# EAGLE design UPCH (EAGLE 7.5.0)
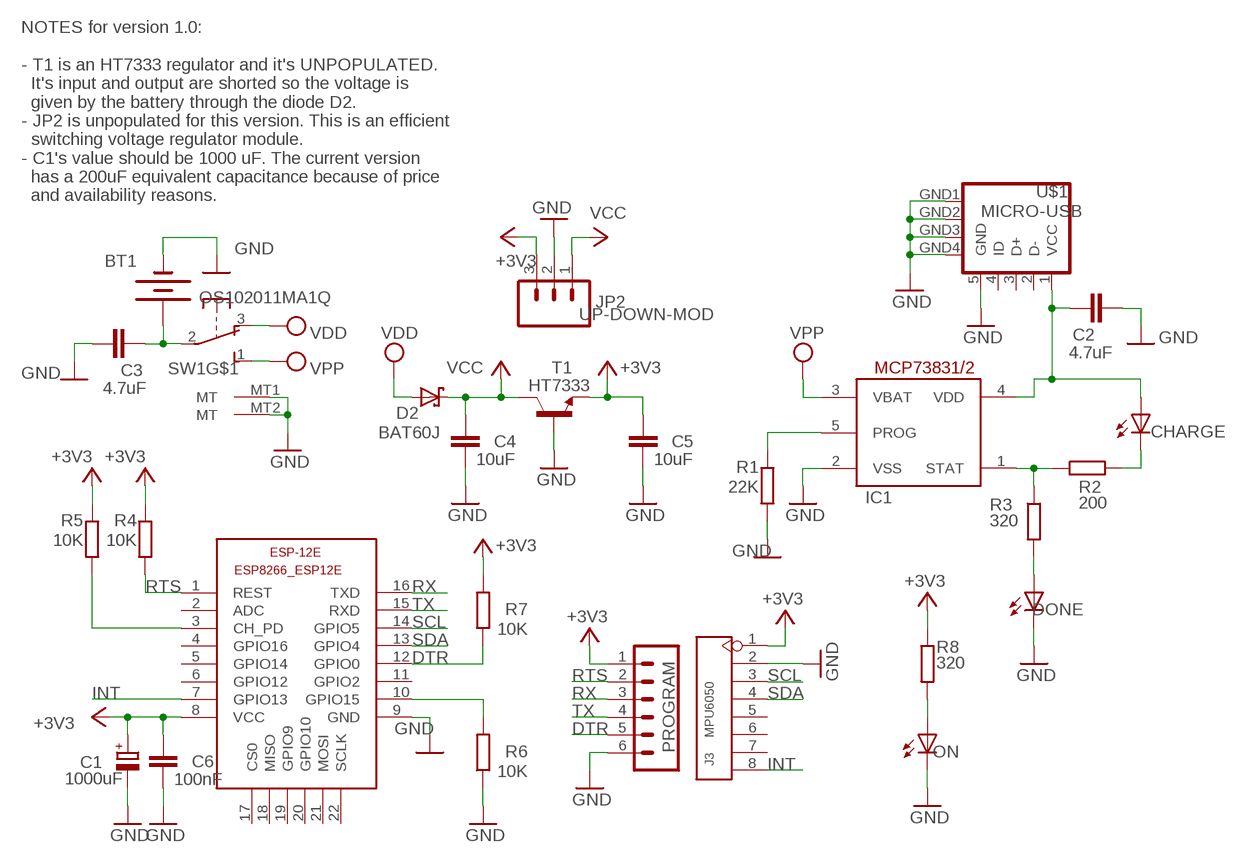
[diagram p0: schematic, sheet 1]

## Parts
BT1  BATTERY24.5MM  [BATTCON_24.5MM]
C1  1000uF  CPOL-EUD/7343-31W  [D/7343-31W]
C2  4.7uF  C-EUC1206  [C1206]
C3  4.7uF  C-EUC1206  [C1206]
C4  10uF  C-EUC1206  [C1206]
C5  10uF  C-EUC1206  [C1206]
C6  100nF  C-EUC1206  [C1206]
CHARGE  LEDCHIP-LED0603  [CHIP-LED0603]
D2  BAT60J  [SOD323_ST]
DONE  LEDCHIP-LED0603  [CHIP-LED0603]
ESP-12E  ESP8266-12EESP8266-ESP12E  [ESP8266-ESP12E]
IC1  MCP73831  MCP73831/OT  [SOT23-5L]
J3  MPU6050  SMD-BLACK-FEMALE-HEADER(8P-2.54-90D)  [H8-SMD-2.54-90D]
JP2  UP-DOWN-MOD  M03PTH  [1X03]
ON  LEDCHIP-LED0603  [CHIP-LED0603]
PROGRAM  CONN_06SILK_FEMALE_PTH  [1X06]
R1  22K  R-EU_R0603  [R0603]
R2  200  R-EU_R1206  [R1206]
R3  320  R-EU_R0603  [R0603]
R4  10K  R-EU_R0603  [R0603]
R5  10K  R-EU_R0603  [R0603]
R6  10K  R-EU_R0603  [R0603]
R7  10K  R-EU_R1206  [R1206]
R8  320  R-EU_R0603  [R0603]
SW1  OS102011MA1Q  [OS102011MA1Q]
T1  HT7333  -NPN-SOT89-BCE  [SOT89-BCE]
U$1  MICRO-USB  [MICRO-USB]

## Nets
+3V3: C1.+ C5.1 C6.1 ESP-12E.8(VCC) J3.1 JP2.3 PROGRAM.1 R4.2 R5.2 R7.2 R8.1 T1.E
DTR: ESP-12E.12(GPIO0) PROGRAM.5 R7.1
GND: BT1.2(-) C1.- C2.2 C3.2 C4.2 C5.2 C6.2 DONE.C ESP-12E.9(GND) IC1.2(VSS) J3.2 JP2.2 ON.C PROGRAM.6 R1.1 R6.1 SW1.MT1(MT) SW1.MT2(MT) T1.B U$1.5(GND) U$1.GND1(GND) U$1.GND2(GND) U$1.GND3(GND) U$1.GND4(GND)
INT: ESP-12E.7(GPIO13) J3.8
N$1: DONE.A R3.2
N$2: IC1.5(PROG) R1.2
N$3: CHARGE.C R2.2
N$4: BT1.1(+) C3.1 SW1.2(P)
N$5: IC1.1(STAT) R2.1 R3.1
N$6: ESP-12E.3(CH_PD) R5.1
N$7: ESP-12E.10(GPIO15) R6.2
N$8: ON.A R8.2
N$9: C2.1 CHARGE.A IC1.4(VDD) U$1.1(VCC)
RTS: ESP-12E.1(REST) PROGRAM.2 R4.1
RX: ESP-12E.16(TXD) PROGRAM.3
SCL: ESP-12E.14(GPIO5) J3.3
SDA: ESP-12E.13(GPIO4) J3.4
TX: ESP-12E.15(RXD) PROGRAM.4
VCC: C4.1 D2.C JP2.1 T1.C
VDD: D2.A SW1.3(O)
VPP: IC1.3(VBAT) SW1.1(S)
Unconnected: ESP-12E.2(ADC) ESP-12E.4(GPIO16) ESP-12E.5(GPIO14) ESP-12E.6(GPIO12) ESP-12E.11(GPIO2) ESP-12E.17(CS0) ESP-12E.18(MISO) ESP-12E.19(GPIO9) ESP-12E.20(GPIO10) ESP-12E.21(MOSI) ESP-12E.22(SCLK) J3.5 J3.6 J3.7 U$1.2(D-) U$1.3(D+) U$1.4(ID)

## Notes on the sheet
- NOTES for version 1.0:
  
  - T1 is an HT7333 regulator and it's UNPOPULATED.
    It's input and output are shorted so the voltage is
    given by the battery through the diode D2.
  - JP2 is unpopulated for this version. This is an efficient
    switching voltage regulator module.
  - C1's value should be 1000 uF. The current version
    has a 200uF equivalent capacitance because of price
    and availability reasons.

## Library data of the parts
BT1 = SparkFun-Retired:BATTERY: Battery - Single Cell A variety of battery chemistries, sizes, and footprints. Including AA, AAA, 18650 (PRT-12895), 20mm coin cell and 12mm coin cell. 20MM_4LEGS, BATT-10373
C1 = rcl:CPOL-EU: POLARIZED CAPACITOR, European symbol
C2-C6 = rcl:C-EU: CAPACITOR, European symbol
CHARGE DONE ON = led:LED: LED OSRAM: - CHIPLED LG R971, LG N971, LY N971, LG Q971, LY Q971, LO R971, LY R971 LH N974, LH R974 LS Q976, LO Q976, LY Q976 LO Q996 - Hyper CHIPLED LW Q18S LB Q993, LB Q99A, LB R99A - SideLED LS A670, LO A670, LY A670, LG A670, LP A670 LB A673, LV A673, LT A673, LW A673 LH A674 LY A675 LS A676, LA A676, LO A676, LY A676, LW A676 LS A679, LY A679, LG A679 - Hyper Micro SIDELED® LS Y876, LA Y876, LO Y876, LY Y876 LT Y87S - SmartLED LW L88C, LW L88S LB L89C, LB L89S, LG L890 LS L89K, LO L89K, LY L89K LS L896, LA L896, LO L896, LY L896 - TOPLED LS T670, LO T670, LY T670, LG T670, LP T670 LSG T670, LSP T670, LSY T670, LOP T670, LYG T670 LG T671, LOG T671, LSG T671 LB T673, LV T673, LT T673, LW T673 LH T674 LS T676, LA T676, LO T676, LY T676, LB T676, LH T676, LSB T676, LW T676 LB T67C, LV T67C, LT T67C, LS T67K, LO T67K, LY T67K, LW E67C LS E67B, LA E67B, LO E67B, LY E67B, LB E67C, LV E67C, LT E67C LW T67C LS T679, LY T679, LG T679 LS T770, LO T770, LY T770, LG T770, LP T770 LB T773, LV T773, LT T773, LW T773 LH T774 LS E675, LA E675, LY E675, LS T675 LS T776, LA T776, LO T776, LY T776, LB T776 LHGB T686 LT T68C, LB T68C - Hyper Mini TOPLED® LB M676 - Mini TOPLED Santana® LG M470 LS M47K, LO M47K, LY M47K Source: http://www.osram.convergy.de LUXEON: - LUMILED® LXK2-PW12-R00, LXK2-PW12-S00, LXK2-PW14-U00, LXK2-PW14-V00 LXK2-PM12-R00, LXK2-PM12-S00, LXK2-PM14-U00 LXK2-PE12-Q00, LXK2-PE12-R00, LXK2-PE12-S00, LXK2-PE14-T00, LXK2-PE14-U00 LXK2-PB12-K00, LXK2-PB12-L00, LXK2-PB12-M00, LXK2-PB14-N00, LXK2-PB14-P00, LXK2-PB14-Q00 LXK2-PR12-L00, LXK2-PR12-M00, LXK2-PR14-Q00, LXK2-PR14-R00 LXK2-PD12-Q00, LXK2-PD12-R00, LXK2-PD12-S00 LXK2-PH12-R00, LXK2-PH12-S00 LXK2-PL12-P00, LXK2-PL12-Q00, LXK2-PL12-R00 Source: www.luxeon.com KINGBRIGHT: KA-3528ASYC Source: www.kingbright.com
D2 = diode:BAT60J: Schottky barrier diode Source: www.st.com, BAT60J.pdf
ESP-12E = ESP8266-ESP12E:ESP8266-12E: ESP8266-12E with additional I/O and GPIO04/05 corrected The author cannot warrant that this library is free from error or will meet your specific requirements. Created by PuceBaboon.com. Komagane, Nagano, JAPAN
IC1 = adafruit:MCP73831: MCP73831/2 Miniature Single-Cell, Fully Integrated Li-Ion, Li-Polymer Charge Management Controllers. Nice and small simple lipoly charge controller, with adjustable current and status output (LED) http://www.ladyada.net/library/pcb/eaglelibrary.html
J3 = Seeed-OPL-Connector:SMD-BLACK-FEMALE-HEADER(8P-2.54-90D): 320030133; MPN: F185-1108A0BZYA1; VALUE: 8p-SMD-2.54-90d
JP2 = SparkFun:M03: Header 3 Standard 3-pin 0.1" header. Use with straight break away headers (SKU : PRT-00116), right angle break away headers (PRT-00553), swiss pins (PRT-00743), machine pins (PRT-00117), and female headers (PRT-00115). Molex polarized connector foot print use with SKU : PRT-08232 with associated crimp pins and housings.
PROGRAM = SparkFun-Connectors:CONN_06: Multi connection point. Often used as Generic Header-pin footprint for 0.1 inch spaced/style header connections On any of the 0.1 inch spaced packages, you can populate with these: Break Away Headers - Straight <https://www.sparkfun.com/products/116> (PRT-00116) Break Away Male Headers - Right Angle <https://www.sparkfun.com/products/553> (PRT-00553) Female Headers <https://www.sparkfun.com/products/115> (PRT-00115) Break Away Headers - Machine Pin <https://www.sparkfun.com/products/117> (PRT-00117) Break Away Female Headers - Swiss Machine Pin <https://www.sparkfun.com/products/743> (PRT-00743) Arduino Stackable Header - 6 Pin <https://www.sparkfun.com/products/9280> (PRT-09280) For SCREWTERMINALS and SPRING TERMINALS visit here: Screw Terimnals on SparkFun.com <https://www.sparkfun.com/search/results?term=Screw+Terminals> (5mm/3.5mm/2.54mm spacing) This device is also useful as a general connection point to wire up your design to another part of your project. Our various solder wires solder well into these plated through hole pads. Hook-Up Wire - Assortment (Stranded, 22 AWG) <https://www.sparkfun.com/products/11375> (PRT-11375) Hook-Up Wire - Assortment (Solid Core, 22 AWG) <https://www.sparkfun.com/products/11367> (PRT-11367) View the entire wire category on our website here <https://www.sparkfun.com/categories/141>; PROD_ID: CONN-08437
R1-R8 = rcl:R-EU_: RESISTOR, European symbol
SW1 = adafruit:OS102011MA1Q: OS10201MA1Q through-hole right angle switch http://www.ladyada.net/library/eagle
T1 = transistor:*-NPN-: NPN Transistror BF959 corrected 2008.03.06
U$1 = MicroUSB:MICRO-USB: Micro USB B connector

## Board
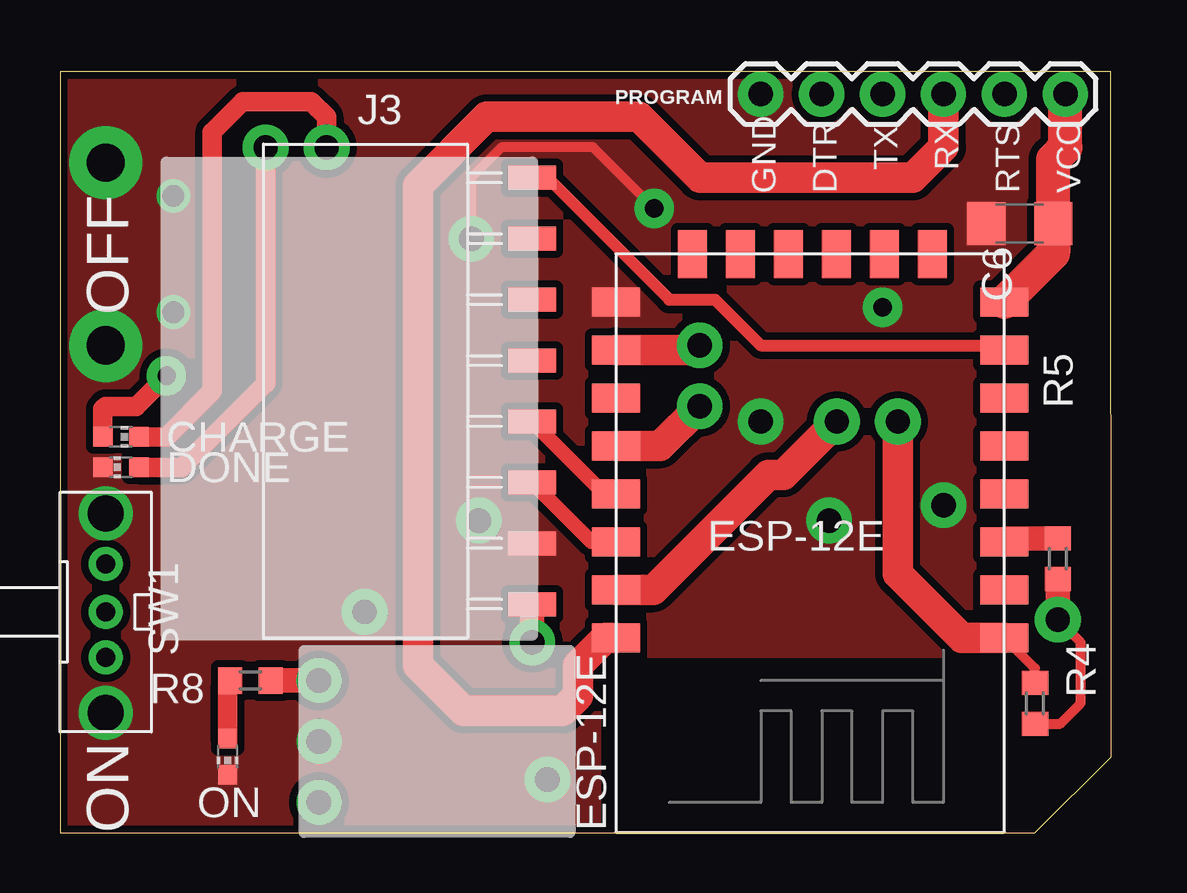
[diagram p1: board, top side]
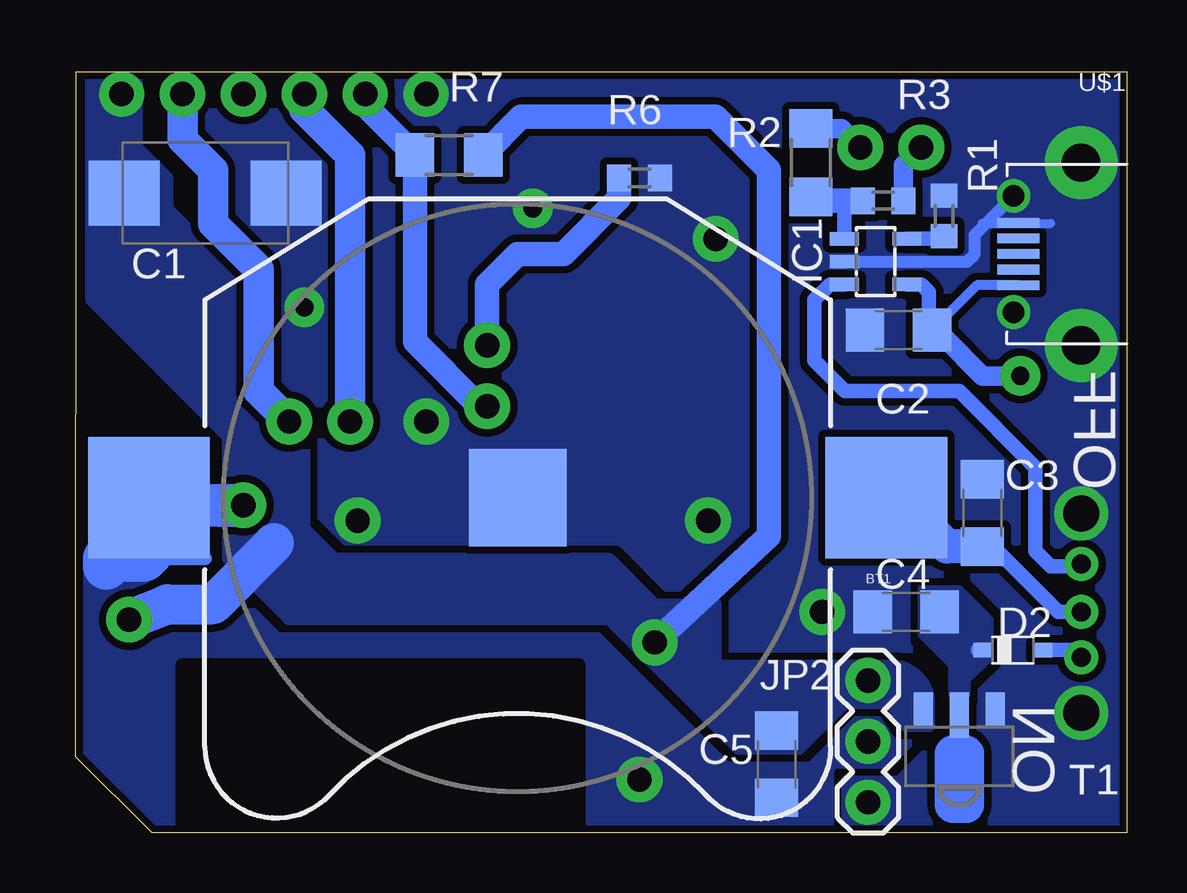
[diagram p2: board, bottom side, seen from below]

Size 43.81 x 31.74 mm. Coordinates in mm from the lower left corner, seen from the top.
Outline: 0,0 40.64,0 43.81,3.17 43.8,31.74 0,31.74 0,0
Copper layers (1*16): Top 0.035mm / dielectric 1.5mm / Bottom 0.035mm
Design rules "default *": minimum track width 6mil, minimum drill 10mil, track to track 6mil, track to pad 6mil, pad to pad 6mil, via to via 6mil, smd to smd 8mil, copper to edge 8mil, drill to drill 8mil, minimum pad ring 10mil, minimum via ring 8mil, stop-mask expansion 4mil, vias tented up to drill 0mil, thermal gap 10mil

### Footprints (pad centres in the part's own frame; a part is rotated, then mirrored left to right if it is on the bottom)
BATTCON_24.5MM = smd 5.08 x 5.08: 1 -15.367,0; 3 15.367,0 | smd 4.064 x 4.064: 2 0,0
D/7343-31W = smd 2.95 x 2.7: + 3.375,0; - -3.375,0
C1206 = smd 1.6 x 1.8: 1 -1.4,0; 2 1.4,0
CHIP-LED0603 = smd 0.8 x 0.8: A 0,-0.75; C 0,0.75
SOD323_ST = smd 0.8 x 0.6: A 1.25,0; C -1.25,0
ESP8266-ESP12E = smd 2 x 1.2: 1 -7.62,5.84; 2 -7.62,3.84; 3 -7.62,1.84; 4 -7.62,-0.16; 5 -7.62,-2.16; 6 -7.62,-4.16; 7 -7.62,-6.16; 8 -7.62,-8.16; 9 8.58,-8.16; 10 8.58,-6.16; 11 8.58,-4.16; 12 8.58,-2.16; 13 8.58,-0.16; 14 8.58,1.84; 15 8.58,3.84; 16 8.58,5.84 | smd 1.2 x 2: 17 -4.62,-10.16; 18 -2.62,-10.16; 19 -0.62,-10.16; 20 1.38,-10.16; 21 3.38,-10.16; 22 5.38,-10.16
SOT23-5L = smd 0.55 x 1.2: 1 -0.95,-1.3; 2 0,-1.3; 3 0.95,-1.3; 4 0.95,1.3; 5 -0.95,1.3
H8-SMD-2.54-90D = smd 2 x 1: 1 0,8.89; 2 0,6.35; 3 0,3.81; 4 0,1.27; 5 0,-1.27; 6 0,-3.81; 7 0,-6.35; 8 0,-8.89
1X03 = drill 1.016 pad 1.88: 1 0,0; 2 2.54,0; 3 5.08,0
1X06 = drill 1.016 pad 1.88: 1 0,0; 2 2.54,0; 3 5.08,0; 4 7.62,0; 5 10.16,0; 6 12.7,0
R0603 = smd 1 x 1.1: 1 -0.85,0; 2 0.85,0
R1206 = smd 1.6 x 1.803: 1 -1.422,0; 2 1.422,0
OS102011MA1Q = drill 0.8 pad 1.422: 1 -2,0; 2 0,0; 3 1.9,0 | drill 1.5 pad 2.184: MT1 -4.1,0; MT2 4.2,0
SOT89-BCE = smd 0.8 x 1.4: B -1.499,-1.981; E 1.499,-1.981 | smd 0.8 x 1.9: C 0,-1.727
MICRO-USB = smd 0.4 x 1.75: 1 -1.3,4.525; 2 -0.65,4.525; 3 0,4.525; 4 0.65,4.525; 5 1.3,4.525 | drill 1.6 pad 3.048: GND1 -3.81,1.905; GND2 3.81,1.905 | drill 0.9: GND3 -2.425,4.725; GND4 2.425,4.725

### Placement (x,y rotation side)
BT1  25.4,13.97 180 bottom
C1  38.42,26.67 180 bottom
C2  9.53,20.95 180 bottom
C3  6.03,13.34 90 bottom
C4  9.21,9.21 180 bottom
C5  14.61,2.86 270 bottom
C6  40.01,25.4 180 top
CHARGE  2.54,16.51 270 top
D2  4.76,7.62 0 bottom
DONE  2.54,15.24 90 top
ESP-12E  31.75,13.97 180 top
IC1  10.48,23.81 270 bottom
J3  19.68,18.41 180 top
JP2  10.79,1.27 90 bottom
ON  6.99,3.17 180 top
PROGRAM  41.91,30.8 180 top
R1  7.62,25.72 270 bottom
R2  13.18,27.94 90 bottom
R3  10.16,26.35 0 bottom
R4  40.64,5.4 270 top
R5  41.59,11.43 270 top
R6  20.32,27.3 180 bottom
R7  28.26,28.26 0 bottom
R8  7.94,6.35 180 top
SW1  1.91,9.21 270 top
T1  6.99,3.17 180 bottom
U$1  0,24.13 90 bottom

### Tracks (layer width: path | path; a pad name or v marks a point on that pad's centre or on a via)
+3V3  (via drill 1.02 pad 1.91)
  Top 0.406: v41.59,8.89 42.55,7.94 42.55,5.4 41.7,4.55 R4.2
  Top 1.016: v19.68,7.94 J3.1 | R5.2 v41.59,8.89 | R8.1 JP2.3
  Top 1.422: ESP-12E.8 41.41,24.16 C6.1 41.41,28.07 41.91,28.57 PROGRAM.1
  Bottom 1.016: v19.68,7.94 14.92,12.38 14.92,27.62 17.14,29.84 25.25,29.84 R7.2
  Bottom 1.676: v41.59,8.89 40.01,9.53 38.1,9.53 35.56,12.06
  pour Bottom (isolate 0.305, no thermals): 9.84,6.99 arc90 8.26,5.4 8.26,4.45 9.21,4.45 9.84,5.4 11.75,5.4 13.65,3.49 16.19,3.49 21.59,8.89 34.92,8.89 37.47,11.43 37.47,16.51 43.18,22.23 43.18,31.43 41.27,31.43 41.27,28.57 40.01,27.3 40.01,26.04 36.2,22.23 36.2,19.05 34.29,17.14 34.29,12.7 33.02,11.43 21.59,11.43 19.68,9.53 17.14,9.53 17.14,6.99
DTR  (via drill 1.02 pad 1.91)
  Top 1.27: ESP-12E.12 25.02,16.13 v26.67,17.78
  Bottom 1.016: PROGRAM.5 31.75,30.33 R7.1 29.68,20.47 26.99,17.78 v26.67,17.78
GND  (via drill 0.76 pad 1.65, 1.02 pad 1.91)
  Top 0.406: v24.77,26.04 22.23,28.57 18.41,28.57 17.14,27.3 v17.14,24.77
  Bottom 0.381: 6.03,25.4 3.17,25.4
  Bottom 0.406: IC1.2 11.75,23.81
  Bottom 0.508: 11.75,23.81 6.67,23.81 6.35,24.13 6.35,24.93 U$1.GND4
  Bottom 1.778: v36.83,13.65 40.96,13.65
  Bottom 1.93: 42.55,11.11 42.55,11.43 40.96,11.43 40.96,13.65 40.96,14.29
  other vias: 32.07,13.02 29.21,17.14 34.29,21.91 17.46,13.02 20.32,2.22 12.7,9.21
  pour Bottom (isolate 0.305, rank 3, no thermals): 0,31.75 43.81,31.75 43.81,3.17 40.64,0 0,0
  pour Top (isolate 0.305, rank 2, no thermals): 0,31.75 43.81,31.75 43.81,3.17 40.64,0 0,0
INT
  Top 0.508: J3.8 20.32,27.3 25.4,22.23 27.3,22.23 29.21,20.32 39.18,20.32 ESP-12E.7
N$1  (via drill 1.02 pad 1.91)
  Top 0.813: DONE.A 5.08,15.24 8.57,18.73 v8.57,28.57
  Bottom 0.813: R3.2 9.31,27.84 v8.57,28.57
N$2
  Bottom 0.61: IC1.5 7.72,24.76 R1.2
N$3  (via drill 1.02 pad 1.91)
  Top 0.813: CHARGE.C 4.45,16.51 6.35,18.41 6.35,29.21 7.62,30.48 10.48,30.48 11.11,29.84 v11.11,28.57
  Bottom 0.813: R2.2 11.9,29.36 v11.11,28.57
N$4
  Bottom 0.61: SW1.2 2.86,9.21 5.4,11.75 5.84,11.75 C3.1
  Bottom 1.422: C3.1 7.49,11.94 9.53,13.97 BT1.1
N$5
  Bottom 0.61: IC1.1 11.78,26.32 11.75,26.35
  Bottom 1.016: R3.1 11.75,26.35 12.53,26.35 R2.1
N$6
  Top 1.016: R5.1 39.52,12.28 ESP-12E.3
N$7  (via drill 1.02 pad 1.91)
  Top 1.27: ESP-12E.10 26.48,20.13 v26.67,20.32
  Bottom 1.016: v26.67,20.32 26.67,22.86 25.4,24.13 23.5,24.13 21.17,26.45 R6.2
N$8
  Top 0.813: ON.A 6.99,6.03 7.09,6.13 R8.2
N$9  (via drill 0.76 pad 1.65)
  Top 0.813: v4.45,19.05 3.17,17.78 1.91,17.78 1.79,17.66 CHARGE.A
  Bottom 0.406: U$1.1 6.25,22.83 C2.1
  Bottom 0.61: IC1.4 8.57,22.86 8.26,22.54 8.26,21.09 C2.1
  Bottom 0.813: C2.1 7.81,20.64 7.62,20.64 6.03,19.05 v4.45,19.05
N$12
  Bottom 0.559: 40.32,11.11 40.01,11.43 38.42,11.43
RTS  (via drill 1.02 pad 1.91)
  Top 0.406: ESP-12E.1 40.64,6.86 R4.1
  Top 1.27: ESP-12E.1 37.59,8.13 34.92,10.79 v34.92,17.14
  Bottom 1.27: PROGRAM.2 39.37,28.89 38.1,27.62 38.1,25.4 36.2,23.5 36.2,18.41 v34.92,17.14
RX
  Top 1.27: ESP-12E.16 22.73,8.13 21.59,6.99 21.59,5.71 20.95,5.08 16.83,5.08 14.92,6.99 14.92,26.99 17.78,29.84 24.13,29.84 26.67,27.3 35.56,27.3 36.83,28.57 PROGRAM.3
SCL
  Top 0.61: ESP-12E.14 22.16,12.13 J3.3
SDA
  Top 0.61: J3.4 22.7,14.13 ESP-12E.13
TX  (via drill 1.02 pad 1.91)
  Top 1.27: ESP-12E.15 24.73,10.13 29.53,14.92 30.16,14.92 v32.38,17.14
  Bottom 1.27: PROGRAM.4 34.29,30.16 32.38,28.26 v32.38,17.14
VCC
  Bottom 0.61: D2.C 6.22,7.62
  pour Bottom (isolate 0.305, rank 2, no thermals): 6.03,0.32 11.75,0.32 11.75,2.22 9.53,2.22 7.3,4.45 7.3,6.99 8.57,8.26 8.57,10.16 6.99,10.16 5.71,8.89 5.71,7.3 6.67,6.35 6.67,4.45 6.03,3.81
VDD
  Bottom 0.61: D2.A 2.22,7.62 SW1.3
VPP
  Bottom 0.61: IC1.3 12.38,22.86 13.02,22.23 13.02,19.68 11.75,18.41 6.99,18.41 3.81,15.24 3.81,11.75 3.17,11.11 2,11.11 SW1.1

### Text on the board
tNames: TX | RX | GND | DTR | RTS | VCC | OFF | ON
bNames: OFF | ON